# EAGLE design Control Hub (EAGLE 6.2)
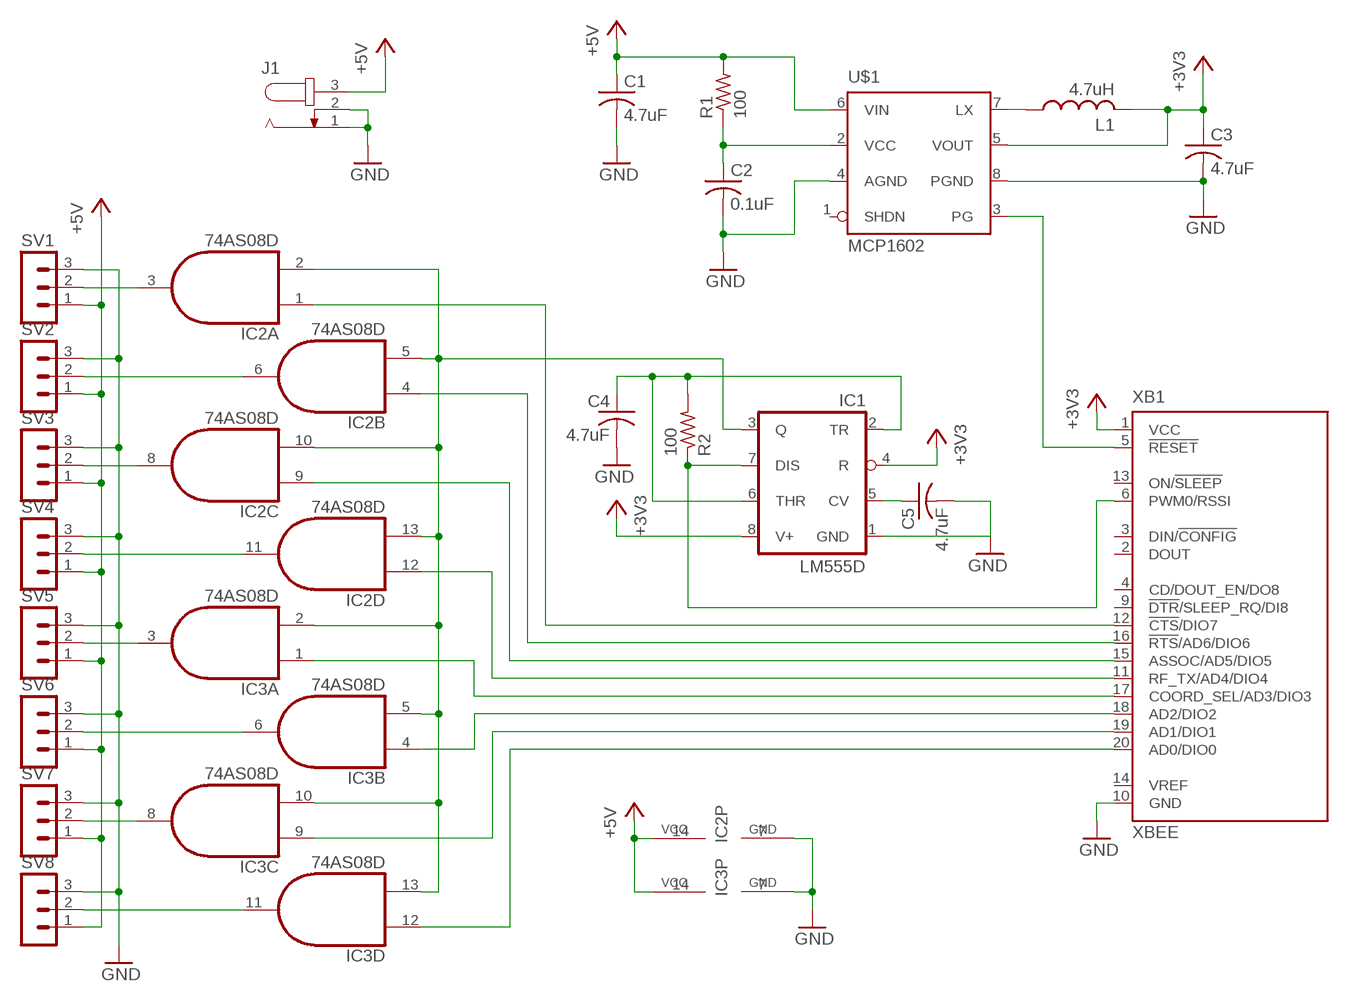
[diagram p0: schematic, sheet 1]

## Parts
C1  4.7uF  C-US050-030X075  [C050-030X075]
C2  0.1uF  C-US050-030X075  [C050-030X075]
C3  4.7uF  C-US050-030X075  [C050-030X075]
C4  4.7uF  C-US050-030X075  [C050-030X075]
C5  4.7uF  C-US050-030X075  [C050-030X075]
IC1  LM555D  [SO08]
IC2  74AS08D  [SO14]
IC3  74AS08D  [SO14]
J1  JACK-PLUG1  [SPC4078]
L1  4.7uH  L-USL3216C  [L3216C]
R1  100  R-US_M3216  [M3216]
R2  100  R-US_M3216  [M3216]
SV1  MA03-1  [MA03-1]
SV2  MA03-1  [MA03-1]
SV3  MA03-1  [MA03-1]
SV4  MA03-1  [MA03-1]
SV5  MA03-1  [MA03-1]
SV6  MA03-1  [MA03-1]
SV7  MA03-1  [MA03-1]
SV8  MA03-1  [MA03-1]
U$1  MCP1602  [MSOP08]
XB1  XBEE  [XBEE]

## Nets
+3V3: IC1.4(R) IC1.8(V+) XB1.1(VCC)
+5V: C1.1 IC2.14(P:VCC) IC3.14(P:VCC) J1.3 R1.2 SV1.1 SV2.1 SV3.1 SV4.1 SV5.1 SV6.1 SV7.1 SV8.1 U$1.6(VIN)
GND: C1.2 C2.2 C3.2 C4.2 C5.2 IC1.1(GND) IC2.7(P:GND) IC3.7(P:GND) J1.1 J1.2 SV1.3 SV2.3 SV3.3 SV4.3 SV5.3 SV6.3 SV7.3 SV8.3 U$1.4(AGND) U$1.8(PGND) XB1.10(GND)
N$1: IC2.3(A:O) SV1.2
N$2: IC2.6(B:O) SV2.2
N$3: IC2.8(C:O) SV3.2
N$4: IC2.11(D:O) SV4.2
N$5: IC3.3(A:O) SV5.2
N$6: IC3.6(B:O) SV6.2
N$7: IC3.8(C:O) SV7.2
N$8: IC3.11(D:O) SV8.2
N$9: C5.1 IC1.5(CV)
N$10: IC3.12(D:I0) XB1.20(AD0/DIO0)
N$11: IC3.9(C:I0) XB1.19(AD1/DIO1)
N$12: IC3.4(B:I0) XB1.18(AD2/DIO2)
N$13: IC3.1(A:I0) XB1.17(COORD_SEL/AD3/DIO3)
N$14: IC2.12(D:I0) XB1.11(RF_TX/AD4/DIO4)
N$15: IC2.9(C:I0) XB1.15(ASSOC/AD5/DIO5)
N$16: IC2.4(B:I0) XB1.16(!RTS!/AD6/DIO6)
N$17: IC2.1(A:I0) XB1.12(!CTS!/DIO7)
N$18: U$1.3(PG) XB1.5(!RESET)
N$19: L1.1 U$1.7(LX)
N$20: C4.1 IC1.2(TR) IC1.6(THR) R2.2
N$21: C2.1 R1.1 U$1.2(VCC)
N$22: IC1.3(Q) IC2.2(A:I1) IC2.5(B:I1) IC2.10(C:I1) IC2.13(D:I1) IC3.2(A:I1) IC3.5(B:I1) IC3.10(C:I1) IC3.13(D:I1)
N$25: IC1.7(DIS) R2.1 XB1.6(PWM0/RSSI)
VOUT: C3.1 L1.2 U$1.5(VOUT) ; supply symbol labelled +3V3
Unconnected: U$1.1(SHDN) XB1.2(DOUT) XB1.3(DIN/!CONFIG) XB1.4(CD/DOUT_EN/DO8) XB1.9(!DTR!/SLEEP_RQ/DI8) XB1.13(ON/!SLEEP) XB1.14(VREF)

## Library data of the parts
C1-C5 = rcl:C-US: CAPACITOR, American symbol
IC1 = linear:*555: TIMER
IC2 IC3 = 74xx-us:74*08: Quad 2-input AND gate
J1 = con-jack:JACK-PLUG: DC POWER JACK Power Jack, DC, Right Angle, Through Hole, Rated 5A at 16VDC, PC Terminals Distributor: Farnell (www.Farnell.de) Drawing: 84N1161.pdf / 84N1162.pdf Manufacturer: SPC Technology (www.spctechnology.com) Type: SPC4077 / SPC 4078; OC_FARNELL: unknown; OC_NEWARK: unknown
L1 = resistor:L-US: INDUCTOR, American symbol
R1 R2 = resistor:R-US_: RESISTOR, American symbol
SV1-SV8 = con-lstb:MA03-1: PIN HEADER; OC_FARNELL: unknown; OC_NEWARK: unknown
U$1 = v-reg-microchip:MCP1602: 3.3V switching regulator
XB1 = maxstream:XBEE: XBee (TM) /XBee-PRO(TM) OEM RF Modules Source: MaxStream, Inc. xbee_productmanual.pdf; MPN: XBP24-Z7UIT-004; OC_FARNELL: 1751799; OC_NEWARK: 34R5507

## Board
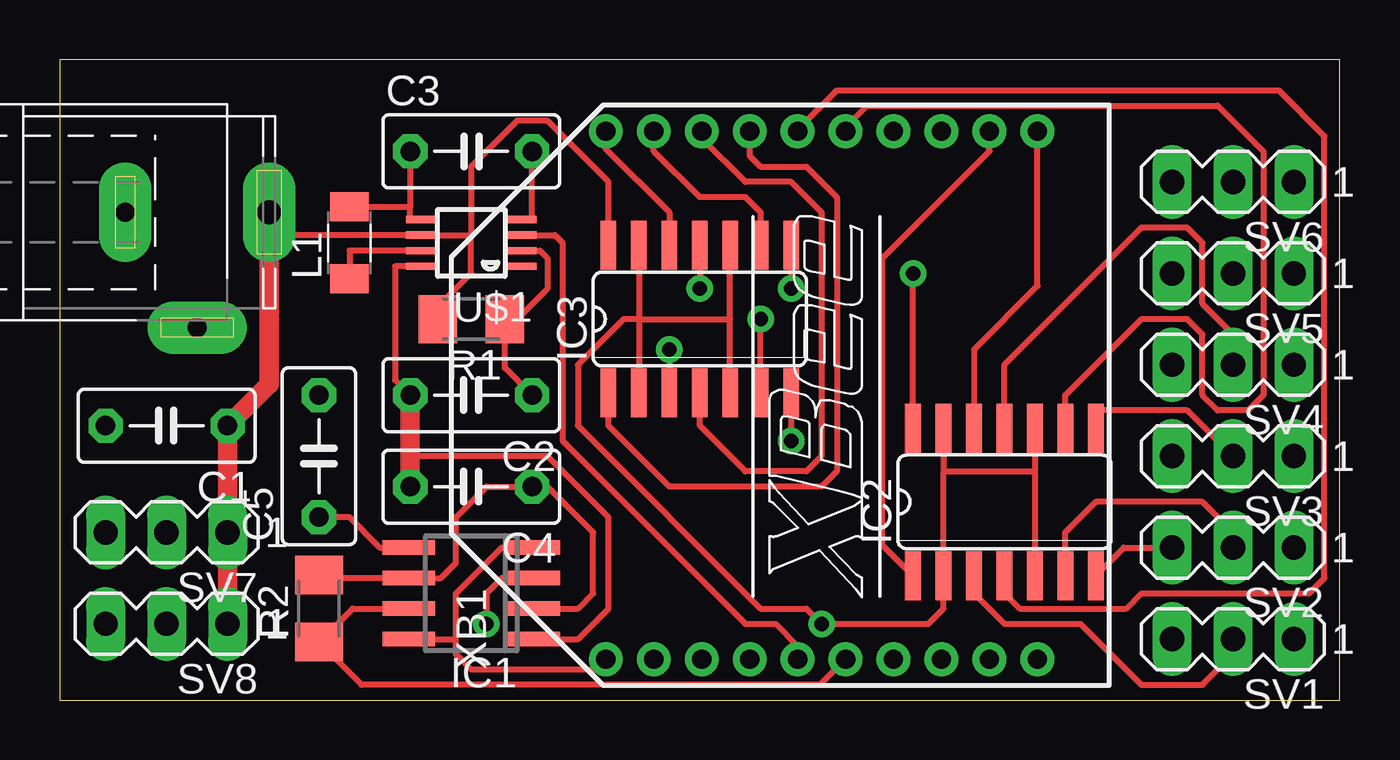
[diagram p1: board, top side]
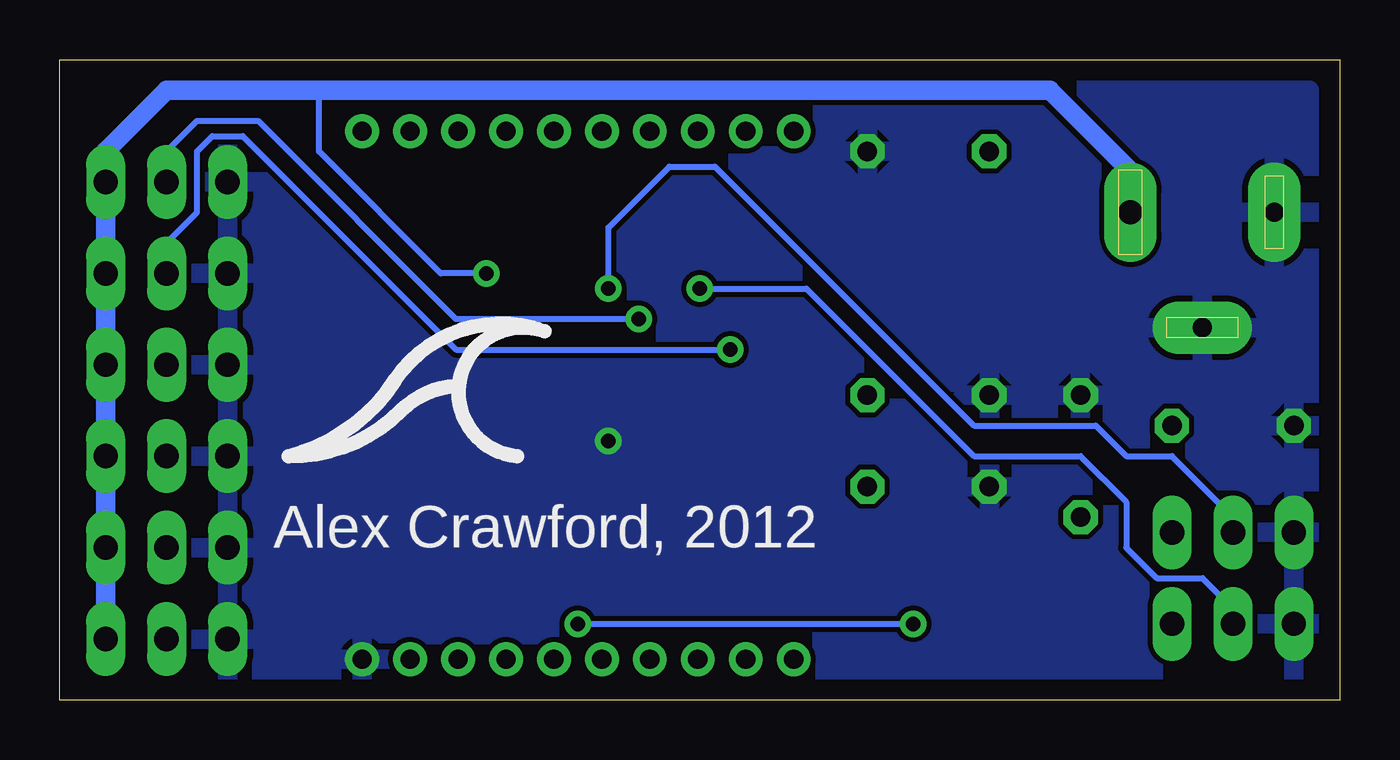
[diagram p2: board, bottom side, seen from below]

Size 53.34 x 26.67 mm. Coordinates in mm from the lower left corner, seen from the top.
Outline: 0,0 53.34,0 53.34,26.67 0,26.67 0,0
Copper layers (1*16): Top 0.035mm / dielectric 1.5mm / Bottom 0.035mm
Design rules: minimum track width 8mil, minimum drill 20mil, track to track 8mil, track to pad 8mil, pad to pad 8mil, via to via 8mil, smd to smd 8mil, copper to edge 10mil, drill to drill 8mil, minimum pad ring 12mil, minimum via ring 10mil, stop-mask expansion 4mil, vias tented up to drill 25mil, thermal gap 10mil

### Footprints (pad centres in the part's own frame; a part is rotated, then mirrored left to right if it is on the bottom)
C050-030X075 = drill 0.813 octagon: 1 -2.54,0; 2 2.54,0
SO08 = smd 0.6 x 2.2: 1 -1.905,-2.6; 2 -0.635,-2.6; 3 0.635,-2.6; 4 1.905,-2.6; 5 1.905,2.6; 6 0.635,2.6; 7 -0.635,2.6; 8 -1.905,2.6
SO14 = smd 0.66 x 2.032: 1 -3.81,-3.073; 2 -2.54,-3.073; 3 -1.27,-3.073; 4 0,-3.073; 5 1.27,-3.073; 6 2.54,-3.073; 7 3.81,-3.073; 8 3.81,3.073; 9 2.54,3.073; 10 1.27,3.073; 11 0,3.073; 12 -1.27,3.073; 13 -2.54,3.073; 14 -3.81,3.073
SPC4078 = drill 0.8 pad 2.184 long: 1 -3,0; 2 0,-4.8 | drill 1 pad 2.184 long: 3 3,0
L3216C = smd 1.2 x 1.6: 1 -1.5,0; 2 1.5,0
M3216 = smd 1.6 x 2: 1 -1.4,0; 2 1.4,0
MA03-1 = drill 1.016 long: 1 -2.54,0; 2 0,0; 3 2.54,0
MSOP08 = smd 0.3 x 1.2: 1 -0.976,-2.113; 2 -0.326,-2.113; 3 0.324,-2.113; 4 0.974,-2.113; 5 0.974,2.112; 6 0.324,2.112; 7 -0.326,2.112; 8 -0.976,2.112
XBEE = drill 0.8 pad 1.27: 1 -11,9; 2 -11,7; 3 -11,5; 4 -11,3; 5 -11,1; 6 -11,-1; 7 -11,-3; 8 -11,-5; 9 -11,-7; 10 -11,-9; 11 11,-9; 12 11,-7; 13 11,-5; 14 11,-3; 15 11,-1; 16 11,1; 17 11,3; 18 11,5; 19 11,7; 20 11,9

### Placement (x,y rotation side)
C1  4.45,11.43 180 top
C2  17.14,12.7 180 top
C3  17.14,22.86 0 top
C4  17.14,8.89 180 top
C5  10.79,10.16 90 top
IC1  17.14,4.45 90 top
IC2  39.37,8.26 0 top
IC3  26.67,15.88 0 top
J1  5.71,20.32 0 top
L1  12.06,19.05 90 top
R1  17.14,15.88 180 top
R2  10.79,3.81 90 top
SV1  48.9,2.54 180 top
SV2  48.9,6.35 180 top
SV3  48.9,10.16 180 top
SV4  48.9,13.97 180 top
SV5  48.9,17.78 180 top
SV6  48.9,21.59 180 top
SV7  4.45,6.99 180 top
SV8  4.45,3.17 180 top
U$1  17.14,19.05 90 top
XB1  31.75,12.7 90 top

### Tracks (layer width: path | path; a pad name or v marks a point on that pad's centre or on a via)
+3V3
  Top 0.254: IC1.8 16.51,2.54 | 16.51,2.54 16.51,4.45 18.41,6.35 IC1.4 | 16.51,2.54 16.51,1.91 17.14,1.27 22.32,1.27 XB1.1
+5V  (via drill 0.6)
  Top 0.254: 17.14,19.37 17.14,17.78 15.74,16.38 R1.2 | 17.14,19.37 U$1.6 9.03,19.37 8.71,19.68 | 22.86,19.68 IC3.14 22.86,21.59 20.32,24.13 19.05,24.13 17.14,22.23 17.14,19.37 | IC2.14 v35.56,17.78
  Top 0.813: SV8.1 SV7.1 C1.1 8.71,13.16 8.71,19.68 J1.3
  Bottom 0.254: v35.56,17.78 37.47,17.78 42.55,22.86 42.55,25.4
  Bottom 0.813: SV1.1 SV2.1 SV3.1 SV4.1 SV5.1 SV6.1 51.44,22.86 48.9,25.4 42.55,25.4 12.06,25.4 8.71,22.05 J1.3
GND  (via drill 0.6)
  Top 0.254: U$1.8 13.97,18.07 13.97,13.34 C2.2 | U$1.4 19.68,20.02 C3.2 | IC1.1 21.59,2.54 22.86,3.81 22.86,7.62 20.32,10.16 14.61,10.16 | IC2.7 44.35,6.35 SV2.3 | IC3.7 v30.48,10.79
  Top 0.813: C2.2 14.61,10.16 C4.2
  pour Bottom: 1.27,25.4 1.27,1.27 52.07,1.27 52.07,25.4
N$1
  Top 0.254: IC2.3 38.1,4.45 39.37,3.17 42.55,3.17 45.09,0.64 47.62,0.64 48.9,1.91 SV1.2
N$2
  Top 0.254: SV2.2 48.9,6.99 47.62,8.26 43.18,8.26 41.91,6.99 IC2.6
N$3
  Top 0.254: SV3.2 46.99,12.06 43.18,12.06 IC2.8
N$4
  Top 0.254: SV4.2 48.9,15.24 47.62,16.51 47.62,19.05 46.99,19.68 45.09,19.68 39.37,13.97 IC2.11
N$5  (via drill 0.6)
  Top 0.254: v25.4,14.61 IC3.3
  Bottom 0.254: SV5.2 48.9,19.05 47.62,20.32 47.62,22.86 46.99,23.5 45.72,23.5 36.83,14.61 v25.4,14.61
N$6  (via drill 0.6)
  Top 0.254: IC3.6 v29.21,15.88
  Bottom 0.254: SV6.2 48.9,22.86 47.62,24.13 45.09,24.13 36.83,15.88 v29.21,15.88
N$7  (via drill 0.6)
  Top 0.254: IC3.8 v30.48,17.14
  Bottom 0.254: SV7.2 4.45,7.62 6.99,10.16 8.89,10.16 10.16,11.43 15.24,11.43 26.04,22.23 27.94,22.23 30.48,19.68 v30.48,17.14
N$8  (via drill 0.6)
  Top 0.254: IC3.11 v26.67,17.14
  Bottom 0.254: SV8.2 4.45,3.81 5.71,5.08 7.62,5.08 8.89,6.35 8.89,8.26 10.79,10.16 15.24,10.16 22.23,17.14 v26.67,17.14
N$9
  Top 0.254: C5.1 12.06,7.62 13.34,6.35 IC1.5
N$10
  Top 0.254: IC3.12 25.4,20.32 22.75,22.97 XB1.20
N$11
  Top 0.254: IC3.9 29.21,20.32 28.57,20.95 26.67,20.95 24.75,22.88 XB1.19
N$12
  Top 0.254: IC3.4 26.67,11.43 28.57,9.53 31.11,9.53 31.75,10.16 31.75,20.32 30.48,21.59 28.57,21.59 26.75,23.41 XB1.18
N$13
  Top 0.254: IC3.1 22.86,11.43 25.4,8.89 31.75,8.89 32.38,9.53 32.38,20.95 31.11,22.23 29.21,22.23 28.75,22.68 XB1.17
N$14
  Top 0.254: IC2.12 38.1,14.61 40.75,17.25 XB1.11
N$15
  Top 0.254: XB1.15 32.75,23.86 33.66,24.77 48.26,24.77 50.16,22.86 50.16,12.7 49.53,12.06 48.26,12.06 47.62,12.7 47.62,15.24 46.99,15.88 45.09,15.88 41.91,12.7 IC2.9
N$16
  Top 0.254: XB1.16 30.75,23.77 32.38,25.4 50.8,25.4 52.7,23.5 52.7,5.08 52.07,4.45 45.09,4.45 44.45,3.81 40.01,3.81 39.37,4.45 IC2.4
N$17
  Top 0.254: IC2.1 34.29,6.45 34.29,18.41 38.75,22.88 XB1.12
N$18
  Top 0.254: U$1.3 20.63,19.37 20.95,19.05 20.95,10.79 28.57,3.17 29.84,3.17 30.75,2.27 XB1.5
N$19
  Top 0.254: U$1.7 12.06,18.72 L1.1
N$20
  Top 0.254: R2.2 10.93,5.08 IC1.6 15.88,5.08 16.51,5.71 16.51,7.62 17.78,8.89 C4.1 20.32,8.89 22.23,6.99 22.23,4.45 21.59,3.81 IC1.2
N$21
  Top 0.254: U$1.2 20.01,18.72 20.32,18.41 20.32,17.14 19.05,15.88 R1.1 18.55,13.84 C2.1
N$22  (via drill 0.6)
  Top 0.254: IC2.10 40.64,9.53 | 40.64,9.53 IC2.5 | IC2.13 36.83,9.53 | 36.83,9.53 40.64,9.53 | IC1.3 18.41,5.08 17.78,4.45 v17.78,3.17 | IC3.13 24.13,15.88 | 24.13,15.88 27.94,15.88 | 27.94,15.88 IC3.10 | 36.83,9.53 IC2.2 36.83,3.81 36.2,3.17 v31.75,3.17 31.11,3.81 29.21,3.81 21.59,11.43 21.59,13.97 23.5,15.88 24.13,15.88 | IC3.5 27.94,15.88 | 24.13,15.88 IC3.2
  Bottom 0.254: v31.75,3.17 v17.78,3.17
N$25
  Top 0.254: IC1.7 12.2,3.81 R2.1 12.57,0.64 31.68,0.64 XB1.6
VOUT
  Top 0.254: C3.1 14.61,20.55 | U$1.5 14.61,20.02 14.61,20.55 | L1.2 14.61,20.55

### Text on the board
bPlace: Alex Crawford, 2012